# Altium project G0-DevBoard.PrjPcb
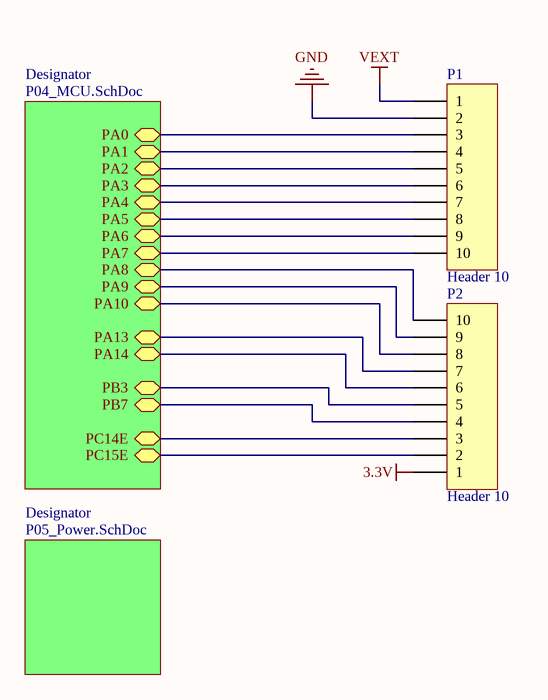
[diagram p0: P03_Design_Block_Diagram.SchDoc]
5 sheets, 35 parts. Net scope: hierarchical (ports join the sheet entries above them; power ports are global).
Board file: P100_G0-DevBoard.PcbDoc
Sheets:
  P01_Cover_Sheet.SchDoc
  P02_Revision_History.SchDoc
  P03_Design_Block_Diagram.SchDoc
    Designator = P04_MCU.SchDoc
    Designator = P05_Power.SchDoc

## Sheet P01_Cover_Sheet.SchDoc
size A4

## Sheet P02_Revision_History.SchDoc
size A4

## Sheet P03_Design_Block_Diagram.SchDoc
size A4

### Parts
P1  Header 10  [HDR_1_10_M_180]
P2  Header 10  [HDR_1_10_M_180]

### Sub-sheets
Designator = P04_MCU.SchDoc: PA0, PA1, PA2, PA3, PA4, PA5, PA6, PA7, PA8, PA9, PA10, PB3, PB7, PA13, PA14, PC14E, PC15E
Designator = P05_Power.SchDoc: no entries

### Nets
3.3V: P2.1
GND: P1.2
VEXT: P1.1
NetJP1_2: P2.6 ; sheet Designator/PA14
NetJP2_2: P2.7 ; sheet Designator/PA13
NetJP3_1: P2.3 ; sheet Designator/PC14E
NetJP4_1: P2.2 ; sheet Designator/PC15E
NetP1_3: P1.3 ; sheet Designator/PA0
NetP1_4: P1.4 ; sheet Designator/PA1
NetP1_5: P1.5 ; sheet Designator/PA2
NetP1_6: P1.6 ; sheet Designator/PA3
NetP1_7: P1.7 ; sheet Designator/PA4
NetP1_8: P1.8 ; sheet Designator/PA5
NetP1_9: P1.9 ; sheet Designator/PA6
NetP1_10: P1.10 ; sheet Designator/PA7
NetP2_4: P2.4 ; sheet Designator/PB7
NetP2_5: P2.5 ; sheet Designator/PB3
NetP2_8: P2.8 ; sheet Designator/PA10
NetP2_9: P2.9 ; sheet Designator/PA9
NetP2_10: P2.10 ; sheet Designator/PA8

### Library data of the parts
P1 P2 = Header 10: Header, 10-Pin; LatestRevisionDate: 17-Jul-2002; LatestRevisionNote: Re-released for DXP Platform.; Publisher: Altium Limited

## Sheet P04_MCU.SchDoc
size A4
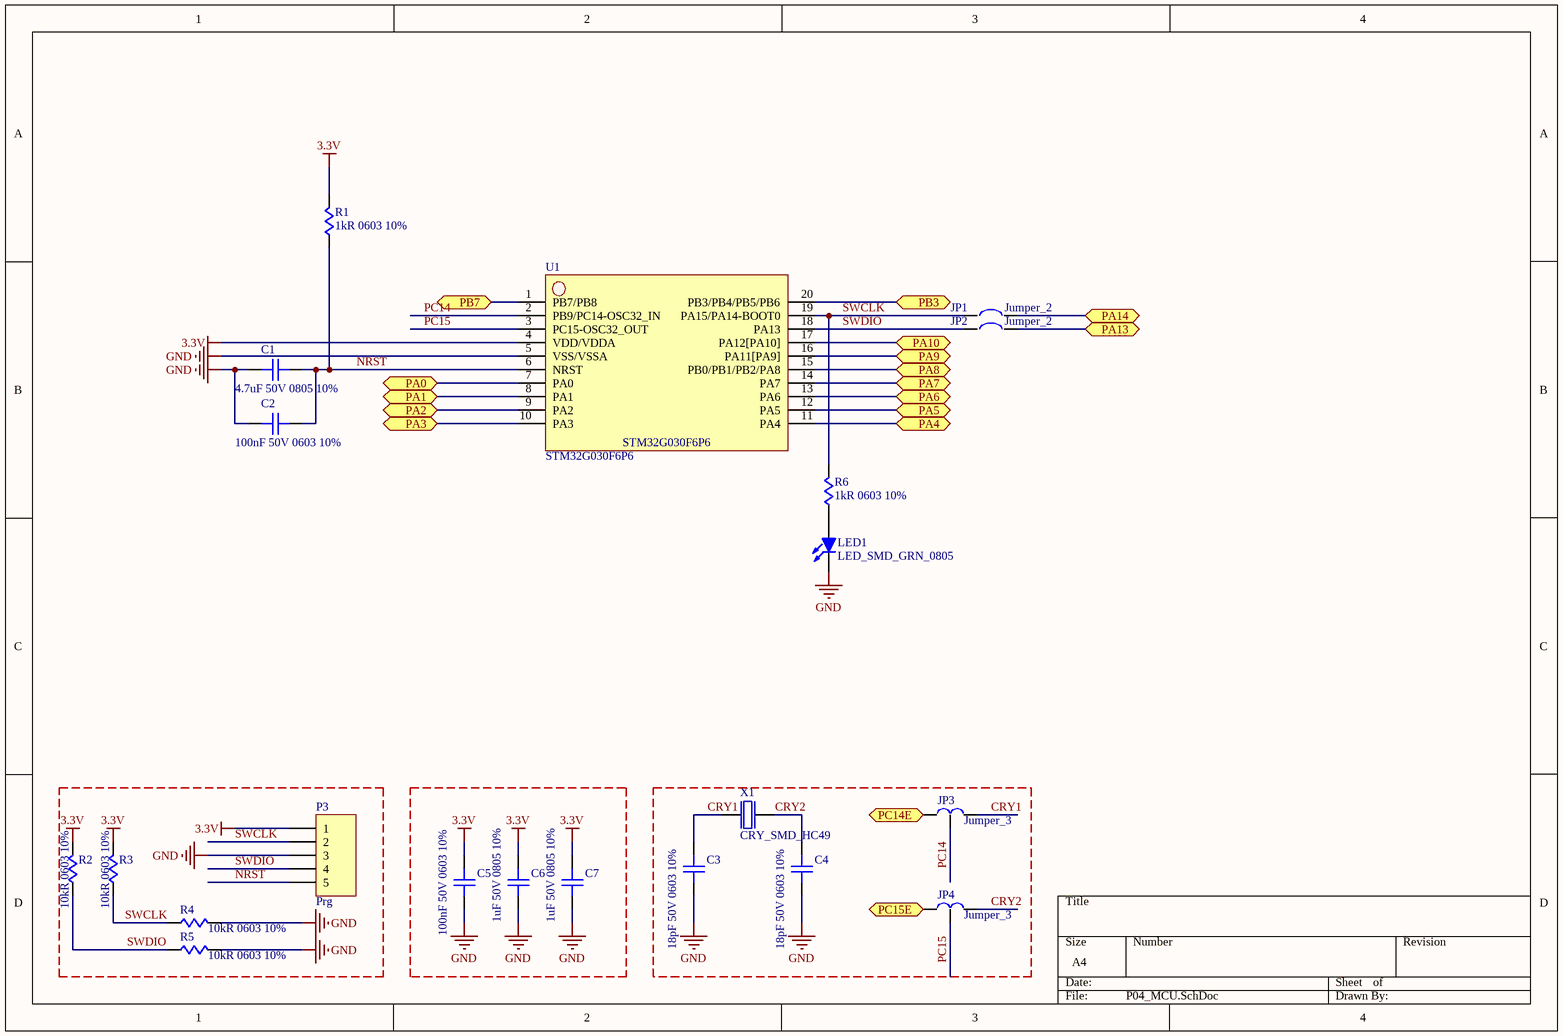
[diagram p1: P04_MCU.SchDoc]

### Parts
C1  4.7uF 50V 0805 10%  [CAPC-0805-M]
C2  100nF 50V 0603 10%  [CAPC-0603-M]
C3  18pF 50V 0603 10%  [CAPC-0603-M]
C4  18pF 50V 0603 10%  [CAPC-0603-M]
C5  100nF 50V 0603 10%  [CAPC-0603-M]
C6  1uF 50V 0805 10%  [CAPC-0805-M]
C7  1uF 50V 0805 10%  [CAPC-0805-M]
JP1  Jumper_2  [JMP_SMD_2]
JP2  Jumper_2  [JMP_SMD_2]
JP3  Jumper_3  [JMP_SMD_3]
JP4  Jumper_3  [JMP_SMD_3]
LED1  LED_SMD_GRN_0805  [LED-GRN-0805-M]
P3  Prg  [HDR_1_5_M_180]
R1  1kR 0603 10%  [RESC-0603-M]
R2  10kR 0603 10%  [RESC-0603-M]
R3  10kR 0603 10%  [RESC-0603-M]
R4  10kR 0603 10%  [RESC-0603-M]
R5  10kR 0603 10%  [RESC-0603-M]
R6  1kR 0603 10%  [RESC-0603-M]
U1  STM32G030F6P6  [TSOP-20-M]
X1  CRY_SMD_HC49  [HC49 US]

### Ports
PA0, PA1, PA2, PA3, PA4, PA5, PA6, PA7, PA8, PA9, PA10, PA13, PA14, PB3, PB7, PC14E, PC15E

### Nets
3.3V: C5.1 C6.1 C7.1 P3.1 R1.2(B) R2.2(B) R3.2(B) U1.4(VDD/VDDA)
GND: C1.2 C2.2 C3.2 C4.2 C5.2 C6.2 C7.2 LED1.2(K) P3.3 R4.2(B) R5.2(B) U1.5(VSS/VSSA)
CRY1: C3.1 JP3.3(C) X1.1(A)
CRY2: C4.1 JP4.3(C) X1.2(B)
NRST: C1.1 C2.1 P3.5 R1.1(A) U1.6(NRST)
PC14: JP3.2(B) U1.2(PB9/PC14-OSC32_IN)
PC15: JP4.2(B) U1.3(PC15-OSC32_OUT)
SWCLK: JP1.1(A) P3.2 R3.1(A) R4.1(A) R6.2(B) U1.19(PA15/PA14-BOOT0)
SWDIO: JP2.1(A) P3.4 R2.1(A) R5.1(A) U1.18(PA13)
NetJP1_2: JP1.2(B) ; port PA14
NetJP2_2: JP2.2(B) ; port PA13
NetJP3_1: JP3.1(A) ; port PC14E
NetJP4_1: JP4.1(A) ; port PC15E
NetLED1_1: LED1.1(A) R6.1(A)
NetP1_3: U1.7(PA0) ; port PA0
NetP1_4: U1.8(PA1) ; port PA1
NetP1_5: U1.9(PA2) ; port PA2
NetP1_6: U1.10(PA3) ; port PA3
NetP1_7: U1.11(PA4) ; port PA4
NetP1_8: U1.12(PA5) ; port PA5
NetP1_9: U1.13(PA6) ; port PA6
NetP1_10: U1.14(PA7) ; port PA7
NetP2_4: U1.1(PB7/PB8) ; port PB7
NetP2_5: U1.20(PB3/PB4/PB5/PB6) ; port PB3
NetP2_8: U1.17(PA12[PA10]) ; port PA10
NetP2_9: U1.16(PA11[PA9]) ; port PA9
NetP2_10: U1.15(PB0/PB1/PB2/PA8) ; port PA8

### Library data of the parts
C1 C6 C7 = CAP_SMD_0805
C2-C5 = CAP_SMD_0603
P3 = Header 5: Header, 5-Pin; LatestRevisionDate: 17-Jul-2002; LatestRevisionNote: Re-released for DXP Platform.; Publisher: Altium Limited
R1-R6 = RES_SMD_0603

## Sheet P05_Power.SchDoc
size A4
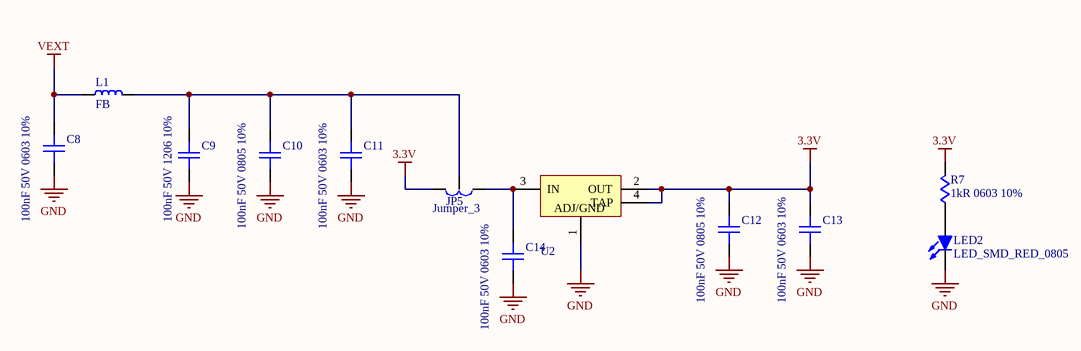
[diagram p2: P05_Power.SchDoc]

### Parts
C8  100nF 50V 0603 10%  [CAPC-0603-M]
C9  100nF 50V 1206 10%  [CAPC-1206-M]
C10  100nF 50V 0805 10%  [CAPC-0805-M]
C11  100nF 50V 0603 10%  [CAPC-0603-M]
C12  100nF 50V 0805 10%  [CAPC-0805-M]
C13  100nF 50V 0603 10%  [CAPC-0603-M]
C14  100nF 50V 0603 10%  [CAPC-0603-M]
JP5  Jumper_3  [JMP_SMD_3]
L1  FB  [INDC-0805-M]
LED2  LED_SMD_RED_0805  [LED-RED-0805-M]
R7  1kR 0603 10%  [RESC-0603-M]
U2  LM1117_3.3V_SMD  [SOT223-4M]  (value not drawn)

### Nets
3.3V: C12.1 C13.1 JP5.3(C) R7.2(B) U2.2(OUT) U2.4(TAP)
GND: C8.2 C9.2 C10.2 C11.2 C12.2 C13.2 C14.2 LED2.2(K) U2.1(ADJ/GND)
VEXT: C8.1 L1.1(A)
NetC9_1: C9.1 C10.1 C11.1 JP5.2(B) L1.2(B)
NetC14_1: C14.1 JP5.1(A) U2.3(IN)
NetLED2_1: LED2.1(A) R7.1(A)

### Library data of the parts
C8 C11 C13 C14 = CAP_SMD_0603
C9 = CAP_SMD_1206
C10 C12 = CAP_SMD_0805
L1 = IND_SMD_0805
R7 = RES_SMD_0603

## Nets that join several sheets
3.3V: P03_Design_Block_Diagram (P2.1), P04_MCU (8 pins), P05_Power (6 pins)
GND: P03_Design_Block_Diagram (P1.2), P04_MCU (12 pins), P05_Power (9 pins)
VEXT: P03_Design_Block_Diagram (P1.1), P05_Power (C8.1 L1.1)
NetJP1_2: P03_Design_Block_Diagram (P2.6), P04_MCU (JP1.2)
NetJP2_2: P03_Design_Block_Diagram (P2.7), P04_MCU (JP2.2)
NetJP3_1: P03_Design_Block_Diagram (P2.3), P04_MCU (JP3.1)
NetJP4_1: P03_Design_Block_Diagram (P2.2), P04_MCU (JP4.1)
NetP1_3: P03_Design_Block_Diagram (P1.3), P04_MCU (U1.7)
NetP1_4: P03_Design_Block_Diagram (P1.4), P04_MCU (U1.8)
NetP1_5: P03_Design_Block_Diagram (P1.5), P04_MCU (U1.9)
NetP1_6: P03_Design_Block_Diagram (P1.6), P04_MCU (U1.10)
NetP1_7: P03_Design_Block_Diagram (P1.7), P04_MCU (U1.11)
NetP1_8: P03_Design_Block_Diagram (P1.8), P04_MCU (U1.12)
NetP1_9: P03_Design_Block_Diagram (P1.9), P04_MCU (U1.13)
NetP1_10: P03_Design_Block_Diagram (P1.10), P04_MCU (U1.14)
NetP2_4: P03_Design_Block_Diagram (P2.4), P04_MCU (U1.1)
NetP2_5: P03_Design_Block_Diagram (P2.5), P04_MCU (U1.20)
NetP2_8: P03_Design_Block_Diagram (P2.8), P04_MCU (U1.17)
NetP2_9: P03_Design_Block_Diagram (P2.9), P04_MCU (U1.16)
NetP2_10: P03_Design_Block_Diagram (P2.10), P04_MCU (U1.15)